# EAGLE design PowerSupply (EAGLE 6.5.0)
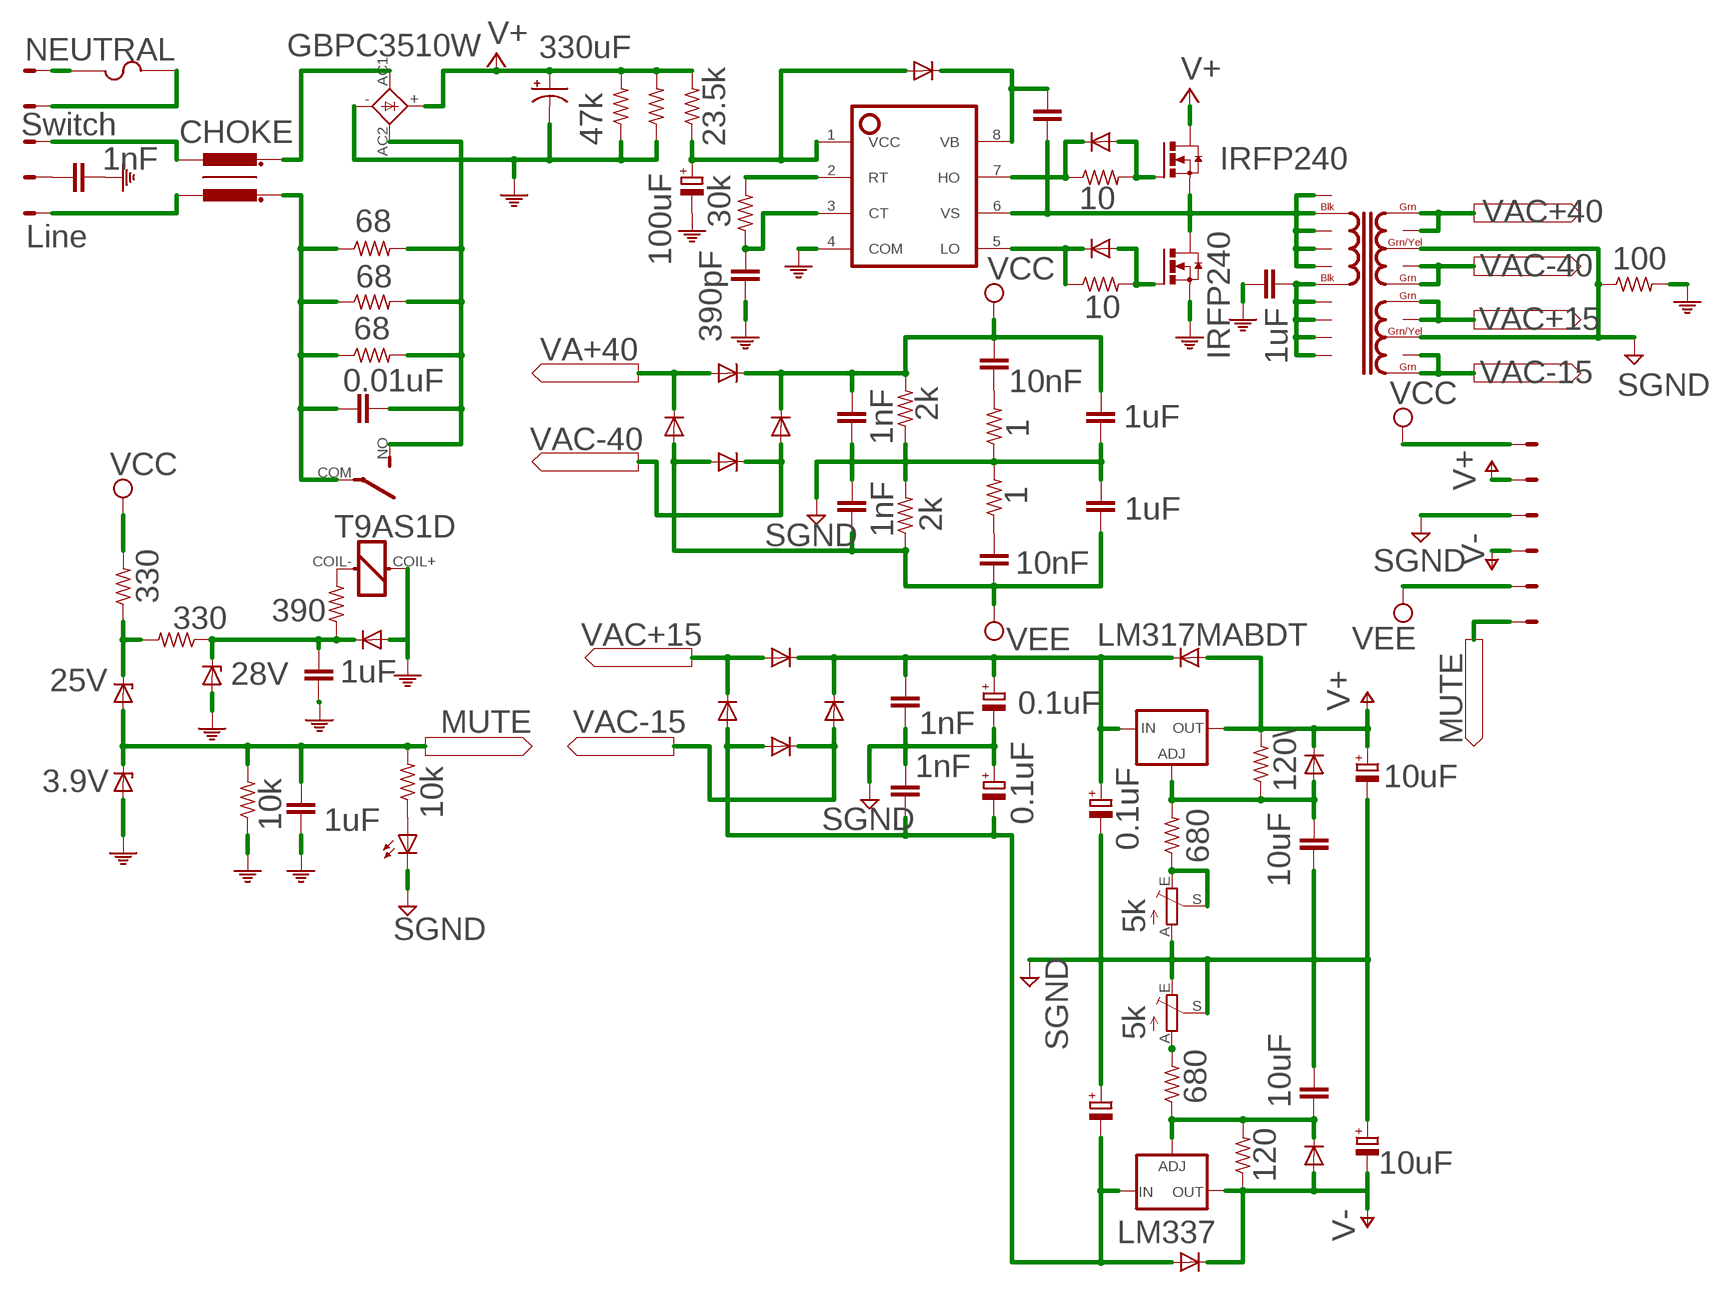
[diagram p0: schematic, sheet 1]

## Parts
C1  390pF  C-EU025-025X050  [C025-025X050]
C2  C-EU050-035X075  [C050-035X075]
C3  10uF  CPOL-EUE2.5-6  [E2,5-6]
C4  100uF  CPOL-EUE2.5-6  [E2,5-6]
C5  330uF  CPOL-USE7.5-18  [E7,5-18]
C6  10uF  C-EU025-025X050  [C025-025X050]
C7  1nF  C-EU102-064X133  [C102-064X133]
C8  1nF  C-EU102-064X133  [C102-064X133]
C9  10nF  C-EU102-064X133  [C102-064X133]
C10  10nF  C-EU102-064X133  [C102-064X133]
C11  1uF  C-EU102-064X133  [C102-064X133]
C12  1uF  C-EU102-064X133  [C102-064X133]
C13  1uF  C-EU102-064X133  [C102-064X133]
C14  10uF  CPOL-EUE2.5-6  [E2,5-6]
C15  1uF  C-EU102-064X133  [C102-064X133]
C16  0.1uF  CPOL-EUE2.5-6  [E2,5-6]
C17  0.01uF  C-EU075-042X103  [C075-042X103]
C18  1nF  C-EU102-064X133  [C102-064X133]
C20  1nF  C-EU102-064X133  [C102-064X133]
C21  0.1uF  CPOL-EUE2.5-6  [E2,5-6]
C22  0.1uF  CPOL-EUE2.5-6  [E2,5-6]
C23  0.1uF  CPOL-EUE2.5-6  [E2,5-6]
C24  10uF  C-EU025-025X050  [C025-025X050]
C26  1uF  C-EU025-025X050  [C025-025X050]
C28  1nF  C-EUC0805K  [C0805K]
D1  1N4004  [1N4004]
D2  25V  ZENER-DIODEP1-Z12  [P1Z12]
D3  3.9V  ZENER-DIODEZD-2.5  [ZDIO-2.5]
D4  28V  ZENER-DIODEP1-Z12  [P1Z12]
D5  VS-ETL1506-M3  [VS-ETL1506-M3]
D6  1N4004  [1N4004]
D7  1N4004  [1N4004]
D8  VS-ETL1506-M3  [VS-ETL1506-M3]
D9  VS-ETL1506-M3  [VS-ETL1506-M3]
D10  VS-ETL1506-M3  [VS-ETL1506-M3]
D11  1N4004  [1N4004]
D12  1N4004  [1N4004]
D13  1N4004  [1N4004]
D14  1N4004  [1N4004]
D15  1N4004  [1N4004]
D16  1N4004  [1N4004]
D17  1N4004  [1N4004]
D18  1N4004  [1N4004]
D19  1N4004  [1N4004]
IC1  LM317MABDT  [DPACK]
IC2  LM337  [LM337]
L2  CHOKE  [CHOKE]
LED2  TLLG4400  [LED3MM]
R1  10k  R-US_0204/2V  [0204V]
R2  2k  R-US_VTA52  [VTA52]
R3  30k  R-US_0204/2V  [0204V]
R4  47k  R-US_0617/5V  [0617V]
R5  23.5k  R-US_0617/5V  [0617V]
R6  330  R-US_0309/V  [0309V]
R7  330  R-US_0309/V  [0309V]
R8  10k  R-US_0204/2V  [0204V]
R9  68  R-US_0617/5V  [0617V]
R10  68  R-US_0617/5V  [0617V]
R11  68  R-US_0617/5V  [0617V]
R12  100  R-US_0207/15  [0207/15]
R13  10  R-US_0204/2V  [0204V]
R14  10  R-US_0204/2V  [0204V]
R15  47k  R-US_0617/5V  [0617V]
R16  2k  R-US_VTA52  [VTA52]
R17  1  R-US_0411/12  [0411/12]
R18  1  R-US_0411/12  [0411/12]
R19  120\  R-US_0204/2V  [0204V]
R20  680  R-US_0204/2V  [0204V]
R21  680  R-US_0204/2V  [0204V]
R22  120  R-US_0204/2V  [0204V]
R23  5k  TRIM_EU-B25P  [B25P]
R24  5k  TRIM_EU-B25P  [B25P]
R25  390  R-US_0204/2V  [0204V]
T1  IRFP240  [IRFP240]
T2  IRFP240  [IRFP240]
TRAFO1  COIL_FORMER  [COIL_FORMER]
U$1  T9AS1D  [RELAY_CM]
U$2  SCREW_TERMINAL_5  [SCREW_TERMINAL_5]
U$3  SCREW_TERMINAL_6  [SCREW_TERMINAL_6]
U$4  FUSE  [FUSE_PADS]
U$5  IRS2153D  [IRS2153D]
U$6  GBPC3510W  [GBPC3510W]

## Nets
EGND: C28.1 U$2.P$3(S2)
GND: C1.1 C4.- C5.- C13.2 C15.2 C26.1 C28.2 D1.A D3.A D4.A R4.1 R8.1 R12.2 R15.1 T2.S U$1.COIL+ U$5.4(COM) U$6.- ; supply symbol labelled PE
LINE: L2.PASS12 U$2.P$2(S1)
MUTE: C15.1 D2.A D3.C R1.2 R8.2 U$3.P$6(S6)
N$1: LED2.A R1.1
N$3: C24.2 D17.C IC2.1(ADJ) R21.1 R22.2
N$4: L2.PASS2 U$6.AC1
N$6: C2.2 D19.C U$5.8(VB)
N$7: C1.2 R3.1 U$5.3(CT)
N$8: C9.2 R17.2
N$9: C26.2 TRAFO1.P$6(P2) TRAFO1.P$7(P22) TRAFO1.P$8(P23) TRAFO1.P$9(P24) TRAFO1.P$10(P25)
N$10: R25.2 U$1.COIL-
N$11: D2.C R6.1 R7.2
N$13: R3.2 U$5.2(RT)
N$14: D6.C R13.1 U$5.7(HO)
N$15: R20.1 R23.E R23.S
N$16: C13.1 D1.C D4.C R7.1 R25.1
N$17: C4.+ D19.A R5.1 U$5.1(VCC)
N$18: C17.2 R9.2 R10.2 R11.2 U$1.NO U$6.AC2
N$19: D6.A R13.2 T1.G
N$20: D7.C R14.1 U$5.5(LO)
N$21: D7.A R14.2 T2.G
N$22: C2.1 T1.S T2.D TRAFO1.P$1(P1) TRAFO1.P$2(P12) TRAFO1.P$3(P13) TRAFO1.P$4(P14) TRAFO1.P$5(P15) U$5.6(VS)
N$23: R21.2 R24.A
N$25: C10.1 R18.1
N$26: C6.1 D12.A IC1.1(ADJ) R19.1 R20.2
NUTRAL: U$2.P$6(S5) U$4.P$1 U$4.P$3
SGND: C3.+ C6.2 C7.2 C8.1 C11.2 C12.1 C14.- C16.- C18.2 C20.1 C21.- C22.+ C23.+ C24.1 LED2.K(C) R2.1 R12.1 R16.2 R17.1 R18.2 R23.A R24.E R24.S TRAFO1.P$13(GND30) TRAFO1.P$18(GND15) U$3.P$3(S3)
SOMENET: C17.1 L2.PASS1 R9.1 R10.1 R11.1 U$1.COM
SWITCH1: U$2.P$5(S4) U$4.P$2 U$4.P$4
SWITCH2: L2.PASS22 U$2.P$4(S3)
V15+: C14.+ D11.A D12.C IC1.4(OUT) R19.2 U$3.P$2(S2) ; supply symbol labelled V+
V15-: C3.- D17.A D18.C IC2.3(OUT) R22.1 U$3.P$4(S4) ; supply symbol labelled V-
V15UN: C16.+ C18.1 C21.+ D11.C D13.C D15.C IC1.3(IN)
V+: C5.+ R4.2 R5.2 R15.2 T1.D U$6.+
V-15UN: C20.2 C22.- C23.- D14.A D16.A D18.A IC2.4(IN)
VAC+15: D13.A D14.C TRAFO1.P$16(SEC15+) TRAFO1.P$17(S15+1)
VAC+40: D5.A D8.C TRAFO1.P$11(SEC30V+) TRAFO1.P$12(S30+1)
VAC-15: D15.A D16.C TRAFO1.P$19(S15-1) TRAFO1.P$20(SEC15-)
VAC-40: D9.A D10.C TRAFO1.P$14(S30-1) TRAFO1.P$15(SEC30-)
VCC: C7.1 C9.1 C11.1 D5.C D9.C R2.2 R6.2 U$3.P$1(S1)
VEE: C8.2 C10.2 C12.2 D8.A D10.A R16.1 U$3.P$5(S5)
Unconnected: D5.NOC1 D5.NOC2 D8.NOC1 D8.NOC2 D9.NOC1 D9.NOC2 D10.NOC1 D10.NOC2 T1.P$3 T1.P$4 T2.P$3 T2.P$4

## Notes on the sheet
- NEUTRAL
- Switch
- Line

## Library data of the parts
C1 C6 C24 C26 = resistor:C-EU: CAPACITOR, European symbol
C2 C7-C13 C15 C17 C18 C20 C28 = rcl:C-EU: CAPACITOR, European symbol
C3 C4 C14 C16 C21-C23 = rcl:CPOL-EU: POLARIZED CAPACITOR, European symbol
C5 = rcl:CPOL-US: POLARIZED CAPACITOR, American symbol
D1 D6 D7 D11-D19 = Amplifier_Parts:1N4004
D2-D4 = diode:ZENER-DIODE: Z-Diode
D5 D8-D10 = Amplifier_Parts:VS-ETL1506-M3
IC1 = v-reg:LM317?*: 500 mA Adjustable Output Positive Voltage Regulator Source: http://www.onsemi.co.jp .. LM317M-D.PDF
IC2 = Amplifier_Parts:LM337
L2 = Amplifier_Parts:CHOKE
LED2 = led:TLLG4400: Low Current (2mA) LED 3 mm Tinted Diffused Package color GREEN Source: Data sheet <http://www.farnell.com/datasheets/391098.pdf>; MF: VISHAY SEMICONDUCTOR; OC_FARNELL: 1612435
R1-R11 R15-R22 R25 = rcl:R-US_: RESISTOR, American symbol
R12-R14 = resistor:R-US_: RESISTOR, American symbol
R23 R24 = pot:TRIM_EU-: POTENTIOMETER
T1 T2 = Amplifier_Parts:IRFP240
TRAFO1 = Amplifier_Parts:COIL_FORMER
U$1 = Amplifier_Parts:T9AS1D
U$2 = Amplifier_Parts:SCREW_TERMINAL_5
U$3 = Amplifier_Parts:SCREW_TERMINAL_6
U$4 = Amplifier_Parts:FUSE
U$5 = Amplifier_Parts:IRS2153D
U$6 = Amplifier_Parts:GBPC3510W

## Board
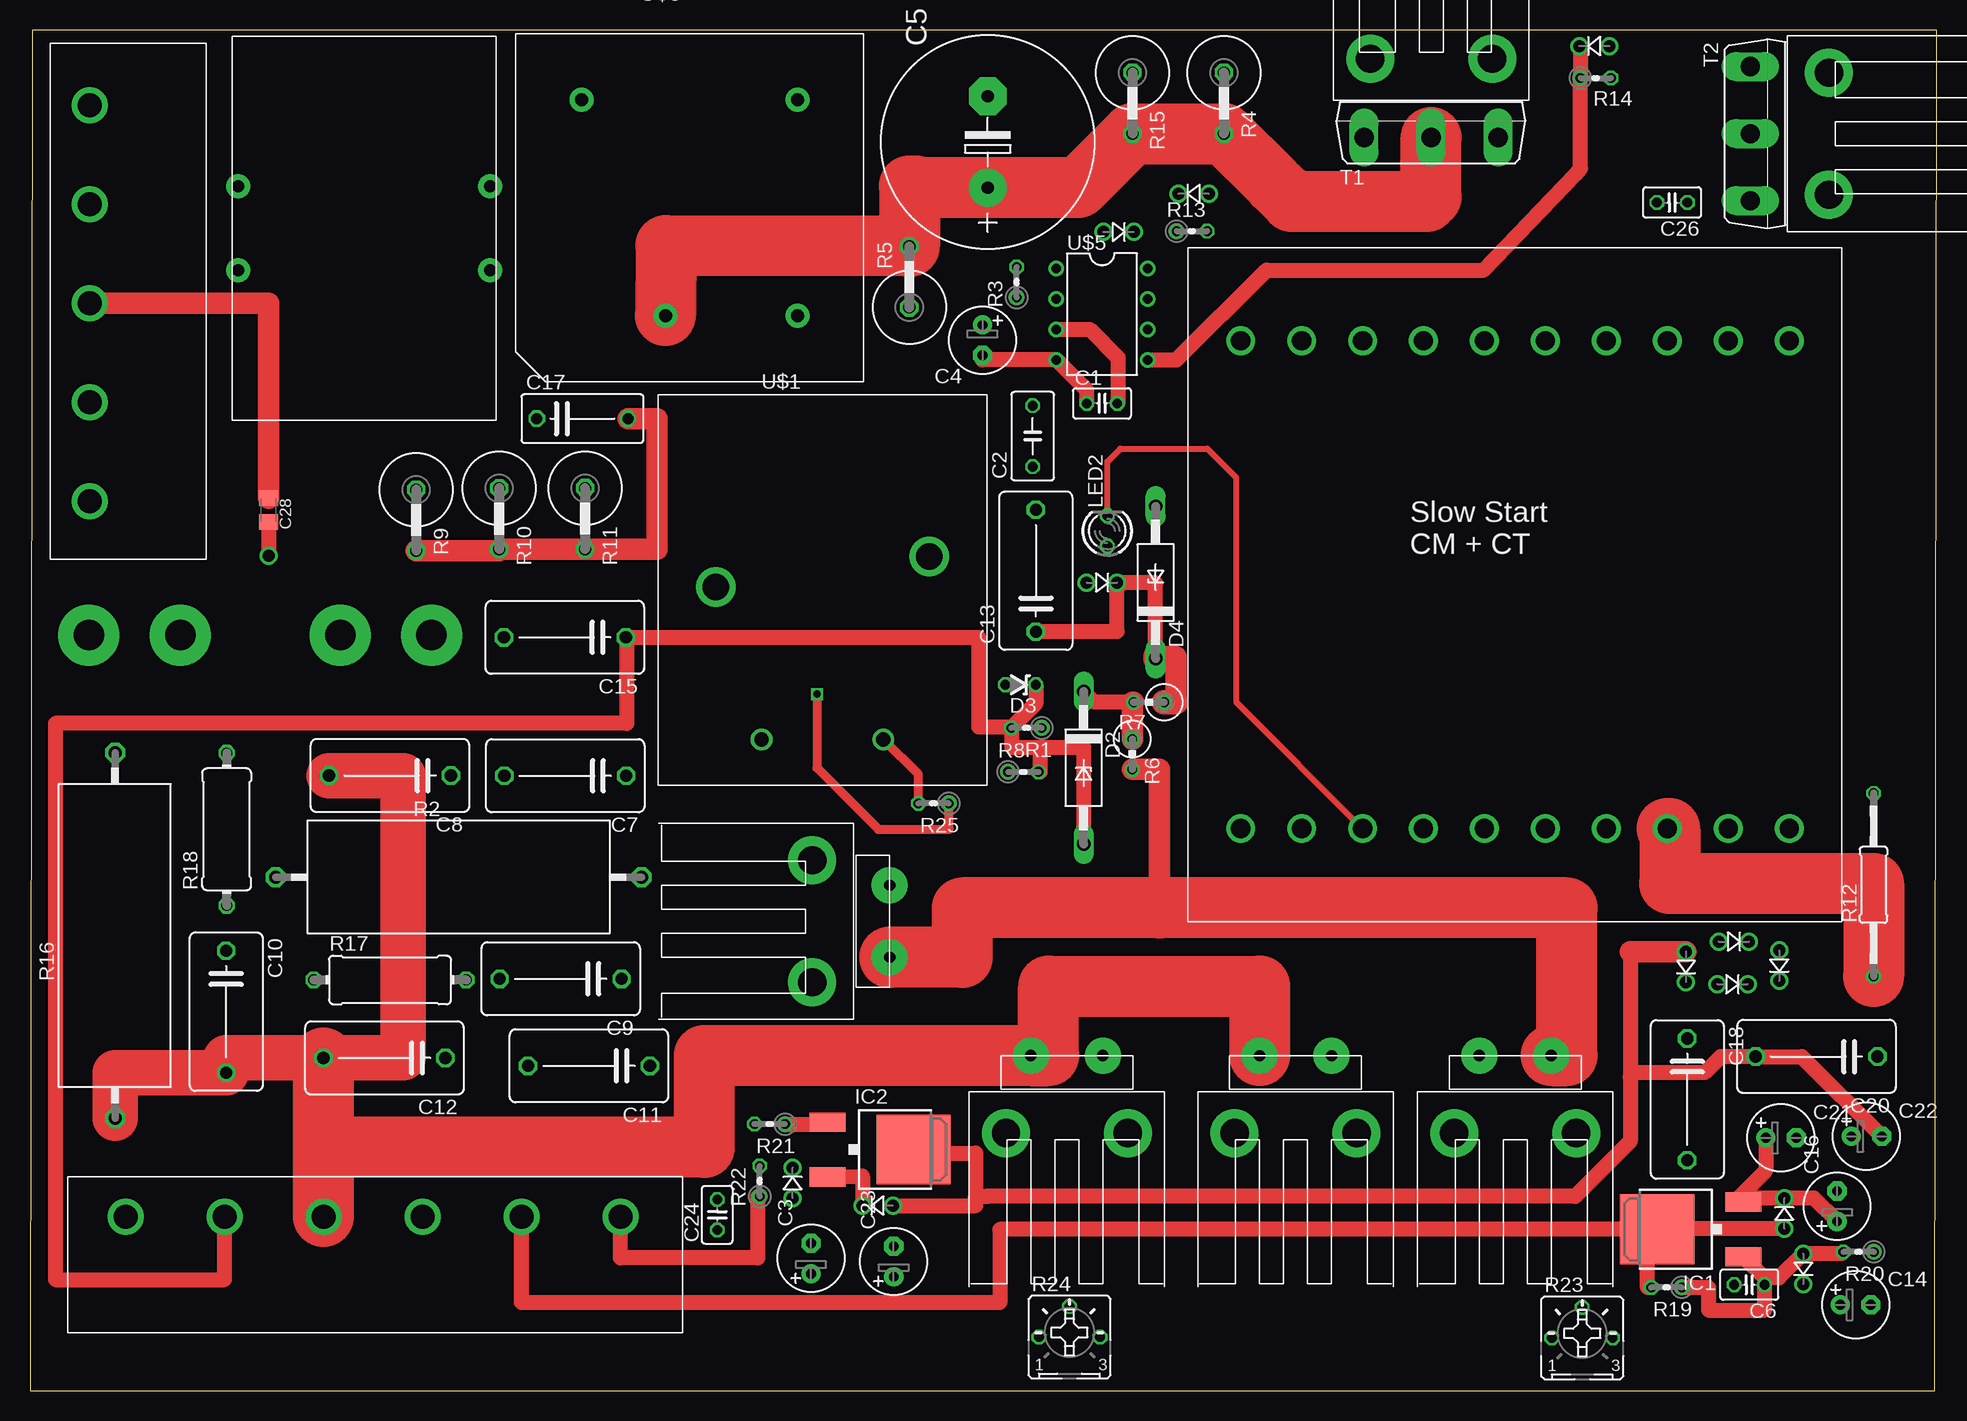
[diagram p1: board, top side]
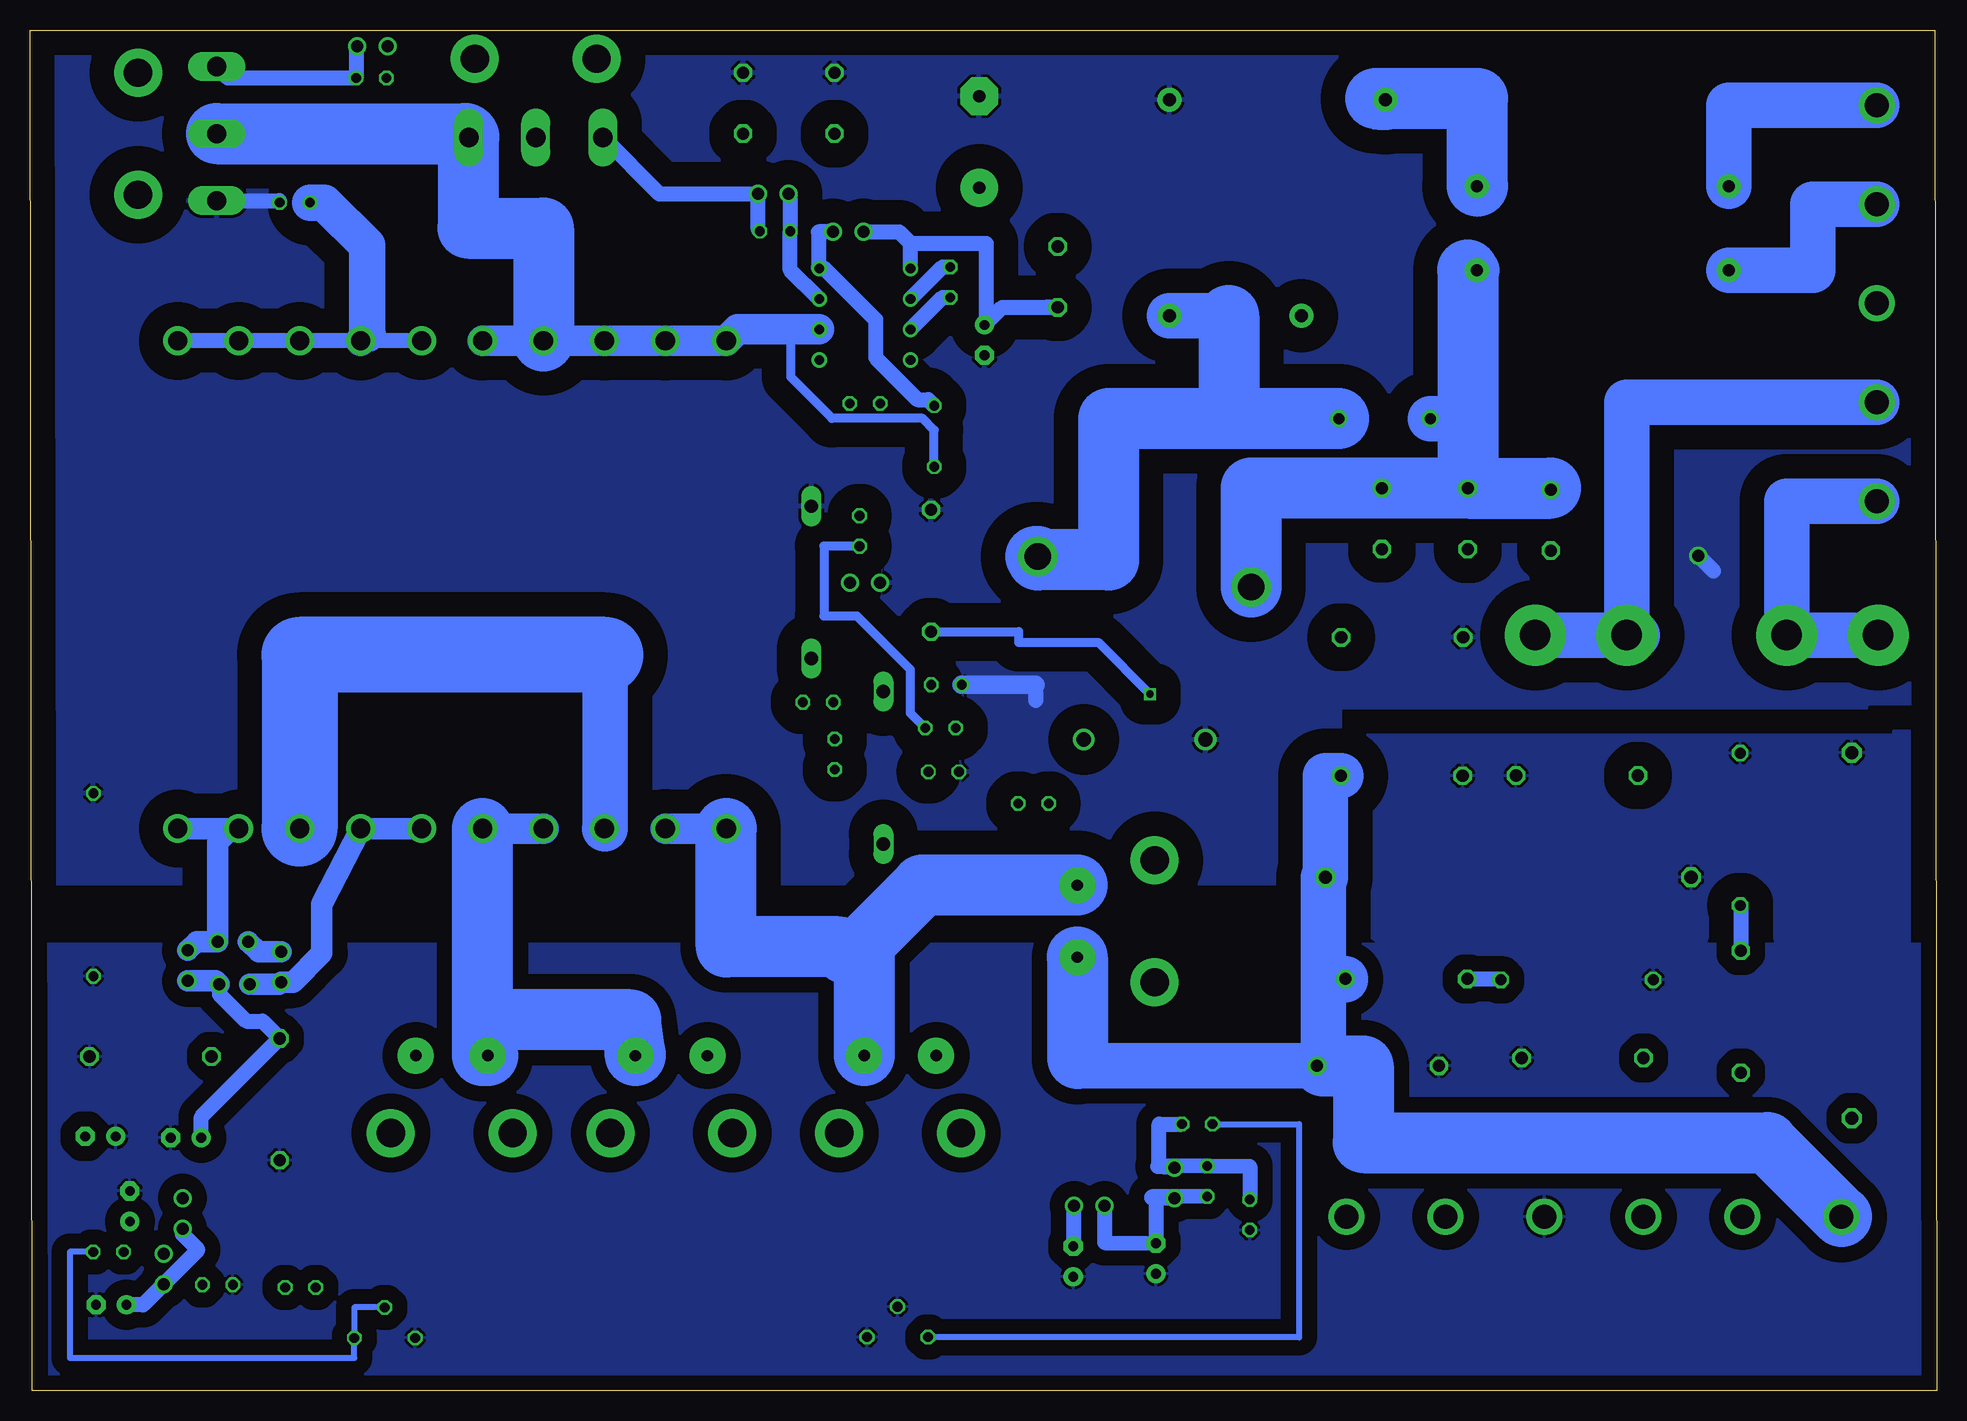
[diagram p2: board, bottom side, seen from below]

Size 158.95 x 113.4 mm. Coordinates in mm from the lower left corner, seen from the top.
Outline: 0,0 158.75,0 158.95,113.4 0.2,113.4 0,0
Copper layers (1*16): Top 0.0178mm / dielectric 59mil / Bottom 0.0178mm
Design rules "epl-lpkf": minimum track width 8mil, minimum drill 0.35mm, track to track 8mil, track to pad 8mil, pad to pad 8mil, via to via 8mil, smd to smd 8mil, copper to edge 15mil, drill to drill 15mil, minimum pad ring 8mil, minimum via ring 8mil, stop-mask expansion 3mil, vias tented up to drill 0mil, thermal gap 10mil

### Footprints (pad centres in the part's own frame; a part is rotated, then mirrored left to right if it is on the bottom)
C025-025X050 = drill 0.813 octagon: 1 -1.27,0; 2 1.27,0
C050-035X075 = drill 0.813 octagon: 1 -2.54,0; 2 2.54,0
E2,5-6 = drill 0.813 pad 1.6: + -1.27,0 | drill 0.813 pad 1.6 octagon: - 1.27,0
E7,5-18 = drill 1.016 pad 3.15: + -3.81,0 | drill 1.016 pad 3.15 octagon: - 3.81,0
C102-064X133 = drill 1.016 octagon: 1 -5.08,0; 2 5.08,0
C075-042X103 = drill 0.914 octagon: 1 -3.81,0; 2 3.81,0
C0805K = smd 1.3 x 1.6: 1 -1,0; 2 1,0
1N4004 = drill 1: A 4.08,0; C 1.54,0
P1Z12 = drill 1.118 long: A 6.35,0; C -6.35,0
ZDIO-2.5 = drill 0.813 octagon: A 1.27,0; C -1.27,0
VS-ETL1506-M3 = drill 0.95 pad 3: A 3,0; C -3,0 | drill 2.36 pad 4: NOC1 -5.08,6.45; NOC2 5.08,6.45
DPACK = smd 1.6 x 3: 1 -2.28,-4.8; 3 2.28,-4.8 | smd 5.8 x 6.2: 4 0,2.38
LM337 = smd 1.6 x 3: 1 -2.28,-4.8; 3 2.28,-4.8 | smd 5.8 x 6.2: 4 0,2.38
CHOKE = drill 1 pad 2: PASS1 -10.5,3.5; PASS2 -10.5,-3.5; PASS12 10.5,3.5; PASS22 10.5,-3.5
LED3MM = drill 0.813 octagon: A -1.27,0; K 1.27,0
0204V = drill 0.813 octagon: 1 -1.27,0; 2 1.27,0
VTA52 = drill 1.1 octagon: 1 -15.24,0; 2 15.24,0
0617V = drill 1.016 octagon: 1 -2.54,0; 2 2.54,0
0309V = drill 0.813 octagon: 1 -1.27,0; 2 1.27,0
0207/15 = drill 0.813 octagon: 1 -7.62,0; 2 7.62,0
0411/12 = drill 0.914 octagon: 1 -6.35,0; 2 6.35,0
B25P = drill 0.813 octagon: A -2.54,0; E 2.54,0; S 0,2.54
IRFP240 = drill 1.6 long: D 0,-2.921; G -5.588,-2.921; S 5.588,-2.921 | drill 2.36 pad 4: P$3 -5.071,3.631; P$4 5.089,3.631
COIL_FORMER = drill 1.6: P$1 -22.86,0; P$2 -17.78,0; P$3 -12.7,0; P$4 -7.62,0; P$5 -2.54,0; P$6 2.54,0; P$7 7.62,0; P$8 12.7,0; P$9 17.78,0; P$10 22.86,0; P$11 -22.86,-40.64; P$12 -17.78,-40.64; P$13 -12.7,-40.64; P$14 -7.62,-40.64; P$15 -2.54,-40.64; P$16 2.54,-40.64; P$17 7.62,-40.64; P$18 12.7,-40.64; P$19 22.86,-40.64; P$20 17.78,-40.64
RELAY_CM = drill 1.2: COIL+ -5.08,-7.62; COIL- 5.08,-7.62 | drill 2.2: COM -8.89,5.08; NO 8.89,7.62
SCREW_TERMINAL_5 = drill 2: P$2 -7.56,2; P$3 0.69,2; P$4 -15.81,2; P$5 8.94,2; P$6 17.19,2
SCREW_TERMINAL_6 = drill 2: P$1 20.36,-1.81; P$2 -12.64,-1.81; P$3 -4.39,-1.81; P$4 -20.89,-1.81; P$5 3.86,-1.81; P$6 12.11,-1.81
FUSE_PADS = drill 2.54 pad 5.08: P$1 -5.08,0; P$2 23.495,0; P$3 2.54,0; P$4 15.875,0
IRS2153D = drill 0.813 pad 1.27: 1 -3.81,-3.81; 2 -1.27,-3.81; 3 1.27,-3.81; 4 3.81,-3.81; 5 3.81,3.81; 6 1.27,3.81; 7 -1.27,3.81; 8 -3.81,3.81
GBPC3510W = drill 1.1 pad 2: + 0,0; - 11,18; AC1 -7,18; AC2 11,0

### Placement (x,y rotation side)
C1  89.36,82.28 0 top
C2  83.58,79.55 90 top
C3  65.1,11.03 90 top
C4  79.39,87.55 270 top
C5  79.83,104.06 90 top
C6  143.32,8.84 180 top
C7  44.61,51.25 180 top
C8  30,51.27 180 top
C9  44.23,34.33 180 top
C10  16.35,31.59 270 top
C11  46.59,27.08 180 top
C12  29.55,27.73 180 top
C13  83.84,68.34 90 top
C14  152.18,7.17 0 top
C15  44.58,62.79 180 top
C16  150.63,15.38 90 top
C17  46.05,81.02 0 top
C18  138.13,24.28 270 top
C20  148.91,27.86 180 top
C21  145.95,21.08 0 top
C22  153.07,21.2 0 top
C23  71.99,10.78 90 top
C24  57.28,14.67 90 top
C26  136.88,99.02 180 top
C28  19.89,73.39 270 top
D1  92.16,67.36 180 top
D2  87.82,51.92 270 top
D3  82.57,58.83 180 top
D4  93.83,67.36 90 top
D5  71.66,39.13 90 top
D6  94.18,99.75 0 top
D7  127.59,112.07 0 top
D8  86.43,27.93 180 top
D9  123.8,27.93 180 top
D10  105.49,27.92 180 top
D11  146.23,17.59 270 top
D12  147.8,7.35 90 top
D13  144.71,33.88 180 top
D14  138.03,32.51 90 top
D15  145.8,32.62 90 top
D16  144.83,37.43 180 top
D17  63.57,20.13 270 top
D18  67.84,15.44 0 top
D19  93.55,96.57 180 top
IC1  138.01,13.46 90 top
IC2  71.27,20.1 270 top
L2  27.85,96.89 180 top
LED2  89.8,71.65 90 top
R1  83.06,55.24 180 top
R2  35.73,42.79 0 top
R3  82.25,92.38 90 top
R4  99.52,107.3 270 top
R5  73.29,92.83 90 top
R6  91.88,53.04 270 top
R7  93.26,57.38 180 top
R8  82.8,51.58 0 top
R9  32.19,72.55 270 top
R10  39.11,72.67 270 top
R11  46.27,72.68 270 top
R12  153.67,42.17 90 top
R13  96.85,96.64 0 top
R14  130.51,109.4 0 top
R15  91.9,107.3 270 top
R16  7.09,37.94 90 top
R17  30.01,34.24 0 top
R18  16.4,46.79 90 top
R19  136.41,8.62 180 top
R20  152.42,11.57 180 top
R21  61.66,22.23 180 top
R22  60.83,17.47 90 top
R23  129.39,4.41 0 top
R24  86.64,4.47 0 top
R25  75.31,48.95 180 top
T1  116.79,107.37 0 top
T2  146.32,104.76 270 top
TRAFO1  123.78,87.49 0 top
U$1  66.06,61.89 0 top
U$2  3,91.3 270 top
U$3  28.32,12.71 180 top
U$4  9.98,62.96 0 top
U$5  89.36,89.71 270 top
U$6  52.97,89.59 0 top

### Tracks (layer width: path | path; a pad name or v marks a point on that pad's centre or on a via)
EGND
  Top 1.778: U$2.P$3 19.89,90.61 C28.1
GND  (via drill 1.02)
  Top 1.27: C1.1 88.09,83.36 U$5.4 79.39,85.9 C4.- | C28.2 v19.89,69.58
  Bottom 1.27: v19.89,69.58 18.62,68.31 | T2.S 138.15,99.18 C26.1 | 75.13,58.83 75.13,57.52
  Bottom 1.524: D3.A 75.13,58.83
  pour Bottom (isolate 2.032, rank 2): 0.2,42.28 157.68,42.28 157.68,113.4 0.2,113.4
LINE
  Bottom 3.81: U$2.P$2 10.36,98.86 10.36,93.39 L2.PASS12
MUTE
  Top 1.27: D3.C 83.84,57.28 R1.2 | 49.73,62.79 79.07,62.79 79.07,55.32 81.79,55.32 R1.2 | R1.2 81.81,55.24 81.81,53.61 84.21,53.61 | 84.21,53.61 87.82,53.61 D2.A | R8.2 84.21,51.58 84.21,53.61 | C15.1 49.73,62.79 | 49.73,62.79 49.73,55.61 2.11,55.61 2.11,9.26 16.21,9.26 U$3.P$6
N$1
  Bottom 0.762: LED2.A 92.79,70.38 92.79,64.58 90.04,64.58 85.59,60.12 85.59,56.49 R1.1
N$3
  Top 1.27: R21.1 66.47,22.23 IC2.1
  Bottom 1.27: 64.95,18.7 R22.2 57.29,18.7 C24.2 | 64.95,18.7 D17.C | 64.95,18.7 64.83,18.7 64.83,22.23 R21.1
N$4
  Bottom 5.08: L2.PASS2 38.3,100.39 38.3,107.68 46.8,107.68 U$6.AC1
N$6
  Bottom 1.27: D19.C 93.23,96.57 93.23,93.59 U$5.8 92.72,93.52 88.47,89.27 88.47,86.09 84.98,82.6 84.09,82.6 C2.2
N$7
  Top 1.27: U$5.3 88.34,88.44 90.69,86.09 90.69,82.35 C1.2
  Bottom 1.27: U$5.3 82.88,91.11 R3.1
N$8
  Bottom 1.27: C9.2 36.36,34.33 R17.2
N$9
  Bottom 1.27: TRAFO1.P$6 TRAFO1.P$7 TRAFO1.P$8 TRAFO1.P$9 TRAFO1.P$10
  Bottom 2.54: 130.81,88.08 TRAFO1.P$7
  Bottom 3.048: C26.2 134.43,99.02 130.85,95.44 130.85,88.11 130.81,88.08
N$10
  Top 0.762: R25.2 74.04,51.36 U$1.COIL-
N$11
  Top 1.27: 91.88,57.38 88.7,57.38 D2.C
  Top 1.778: R7.2 91.88,57.38 R6.1
N$13
  Bottom 1.27: U$5.2 82.88,93.65 R3.2
N$14
  Bottom 1.27: D6.C 95.58,99.6 R13.1 95.58,93.4 U$5.7
N$15
  Bottom 0.508: R20.1 155.64,11.57 155.64,2.74 131.93,2.74 R23.E 131.93,6.95 R23.S
N$16  (via drill 0.6)
  Top 0.762: v65.6,58.06 65.6,51.9 70.72,46.78 76.58,46.78 76.62,46.82 76.62,48.91 R25.1
  Top 1.27: 93.83,61.15 93.83,67.31 93.82,67.32 91.15,67.32 D1.C 90.62,63.26 C13.1
  Top 1.778: 95.53,57.38 95.53,61.15 93.83,61.15
  Top 2.032: 95.53,57.38 R7.1 | 93.83,61.15 D4.C
  Bottom 0.762: C13.1 76.54,63.26 76.54,62.38 69.91,62.38 v65.6,58.06
N$17
  Bottom 1.27: 74.29,90.29 R5.1 77.93,90.29 C4.+ 79.26,88.82 79.26,95.62 85.55,95.62 | U$5.1 85.55,95.62 | D19.A 86.5,96.57 85.55,95.62
N$18
  Top 1.778: R9.2 39.11,70.01 R10.2 R11.2 52.27,70.14 52.27,81.02 C17.2
  Bottom 3.81: U$6.AC2 59.03,89.59
  Bottom 5.08: C17.2 59.03,81.02 | 59.03,81.02 64.37,81.02 64.37,81.01 69.05,81.01 69.05,69.23 74.95,69.23 U$1.NO 75.13,69.51 | 59.03,89.59 59.03,81.02
N$19
  Bottom 1.27: T1.G 106.5,99.75 D6.A 98.26,96.78 R13.2
N$20
  Top 1.27: U$5.5 95.58,85.9 103.07,93.4 121.17,93.4 128.79,101.33 129.24,101.84 R14.1 129.24,111.95 D7.C
N$21
  Bottom 1.27: D7.A 131.78,111.95 R14.2 142.44,109.4 T2.G
N$22
  Bottom 0.762: C2.1 83.58,80.06 84.56,81.04 92.1,81.04 95.53,84.47 95.53,88.44
  Bottom 2.54: U$5.6 95.53,88.44 99.96,88.44 TRAFO1.P$1 TRAFO1.P$2 TRAFO1.P$3 TRAFO1.P$4 TRAFO1.P$5
  Bottom 5.08: T2.D 122.7,104.76 arc90 T1.S 122.44,104.45 122.44,96.89 116.16,96.89 TRAFO1.P$4
N$23
  Bottom 0.508: R21.2 53.18,22.23 53.18,4.46 84.1,4.46 R24.A
N$25
  Bottom 1.27: R18.1 16.35,40.44 C10.1
N$26
  Top 1.27: IC1.1 144.59,9.41 | 144.59,9.41 C6.1 144.59,6.72 139.9,6.72 139.9,8.62 R19.1 | 144.59,9.41 145.79,9.41 D12.A 151.01,11.43 R20.2
NUTRAL
  Bottom 3.81: U$2.P$6 12.52,74.11 U$4.P$3 U$4.P$1
SGND
  Top 0.508: LED2.K 89.8,77.43 90.88,78.51 98.14,78.51 100.52,76.13 100.52,57.4 TRAFO1.P$13
  Top 5.08: TRAFO1.P$18 136.68,46.85 136.68,42.29 153.67,42.29 R12.1
  Bottom 3.81: TRAFO1.P$13 111.01,46.85 111.01,61.33
  Bottom 6.35: 111.01,61.33 136.48,61.33 TRAFO1.P$18
  pour Bottom (isolate 1.27): 0.2,37.2 157.68,37.2 157.62,0.95 0.48,0.95
  pour Bottom (isolate 2.032): 2.26,29.58 2.26,54.98 3.63,54.98 3.63,54.64 54.04,54.64 54.04,42.64 61.58,42.64 61.58,29.58
SOMENET
  Bottom 3.81: L2.PASS1 39.11,93.39 | 32.19,75.21 R9.1 | R11.1 | C17.1 39.11,81.02 39.11,81.01
  Bottom 5.08: 39.11,93.39 39.11,81.02 | 39.11,81.01 R10.1 | R10.1 32.19,75.21 | R10.1 R11.1 | R11.1 57.17,75.22 U$1.COM
SWITCH1
  Bottom 3.81: U$4.P$2 U$4.P$4 | U$4.P$4 24.97,62.96 | U$2.P$5 25.86,82.36 U$4.P$4
SWITCH2
  Bottom 3.81: U$2.P$4 17.35,107.11 L2.PASS22
V15+
  Top 1.27: 134.82,13.46 IC1.4 135.63,13.51 D11.A | 134.82,13.46 80.85,13.46 80.85,7.35 40.96,7.35 U$3.P$2 | R19.2 134.82,8.62 134.82,13.46
  Bottom 1.27: C14.+ 149.53,7.17 D12.C 144.98,11.71 144.98,11.8 146.23,13.05 D11.A
V15-
  Top 1.27: IC2.3 69.38,17.88 D18.C | R22.1 60.66,16.2 60.66,11.08 49.21,11.08 U$3.P$4
  Bottom 1.27: R22.1 65.47,16.16 | 65.47,16.16 65.47,16.08 64.95,16.08 D17.A | D18.C 69.38,12.34 C3.- 65.1,16.16 65.47,16.16
V15UN
  Top 1.27: C21.+ 144.68,18.35 142.22,15.9 142.66,15.9 IC1.3 143.12,16.05 D11.C 148.69,16.05 C16.+
  Bottom 1.27: D13.C 143.17,33.04 140.93,30.8 139.57,30.8 C18.1 144.68,22.82 C21.+
  Bottom 1.778: D15.C 143.45,34.16 D13.C
V+
  Top 5.08: 103.71,100.57 R4.2 R15.2 87.39,100.26 C5.+ 73.86,100.26 73.86,100.38 73.29,100.38 R5.2 53,95.44 U$6.+ | 103.71,100.57 105.3,99.11 | 103.71,100.57 105.17,99.11 105.3,99.11 | 105.3,99.11 116.41,99.11 116.79,99.49 T1.D
V-15UN
  Top 1.27: 133.38,36.59 133.38,26.16 | 133.38,26.16 133.38,20.79 128.8,16.21 79.81,16.21 79.81,16.23 78.83,16.23 | 133.38,26.16 133.74,26.52 139.59,26.52 140.93,27.86 C20.2 147.69,27.86 C22.- | 74.75,19.81 78.83,19.81 78.83,16.23 | D18.A 78.83,15.44 78.83,16.23
  Top 1.778: D14.A 133.38,36.59 | 74.75,19.81 IC2.4
  Bottom 1.27: D18.A 71.99,15.44 C23.-
  Bottom 1.778: D14.A 139.91,36.59 D16.A
VAC+15
  Bottom 1.778: TRAFO1.P$16 TRAFO1.P$17 134.62,40.54 134.62,36.46 137.04,34.05 D14.C 138.2,33.88 D13.A
VAC+40
  Bottom 2.54: TRAFO1.P$12 TRAFO1.P$11
  Bottom 5.08: D8.C 89.43,36.7 91.54,36.99 | 91.54,36.99 100.92,36.99 TRAFO1.P$11 | D5.A 84.56,42.13 90.26,36.43 90.98,36.43 91.54,36.99
VAC-15
  Bottom 1.778: TRAFO1.P$20 142.17,46.85 | 142.17,46.85 TRAFO1.P$19 | 142.17,46.85 143.29,45.73 D16.C 145.07,37.43 D15.A
VAC-40
  Bottom 2.54: TRAFO1.P$15 TRAFO1.P$14
  Bottom 5.08: D9.A 121.24,27.93 121.24,30.91 | 121.24,30.91 TRAFO1.P$15 | D10.C 108.53,28.27 108.87,30.91 121.24,30.91
VCC
  Top 1.778: R6.2 94.16,51.78 94.16,40.23
  Top 5.08: D9.C 128.11,27.93 128.11,40.23 94.16,40.23 77.7,40.23 77.7,36.12 D5.C
  Bottom 3.81: C7.1 50.97,51.25 R2.2 51.15,42.79 51.15,34.27 | 51.15,34.27 49.31,34.27 C9.1 | 51.15,34.27 51.15,27.08 C11.1 71.68,27.08 71.64,27.68
  Bottom 5.08: D5.C 71.64,27.68 | 51.15,27.08 47.83,27.08 47.83,20.69 14.13,20.69 U$3.P$1
VEE
  Top 3.81: C8.2 24.92,51.23 31.11,51.23 31.11,27.73 C12.2 16.35,27.73 C10.2 7.09,26.51 R16.1
  Top 5.08: D10.A 102.5,33.72 84.9,33.72 84.9,27.93 D8.A 56.2,27.93 56.2,20.29 24.47,20.29 | 24.47,20.29 C12.2 | U$3.P$5 24.47,20.29

### Text on the board
tPlace: Slow Start / CM + CT